# EAGLE design riffle-CTL-0.3-cap (EAGLE 7.3.0)
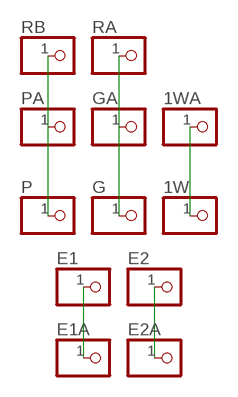
[diagram p0: schematic, sheet 1]

## Parts
1W  PINHD-1X1  [1X01]
1WA  PINHD-1X1  [1X01]
E1  PINHD-1X1  [1X01]
E1A  PINHD-1X1  [1X01]
E2  PINHD-1X1  [1X01]
E2A  PINHD-1X1  [1X01]
G  PINHD-1X1  [1X01]
GA  PINHD-1X1  [1X01]
P  PINHD-1X1  [1X01]
PA  PINHD-1X1  [1X01]
RA  PINHD-1X1  [1X01]
RB  PINHD-1X1  [1X01]

## Nets
N$1: P.1 PA.1 RB.1
N$2: G.1 GA.1 RA.1
N$3: 1W.1 1WA.1
N$4: E1.1 E1A.1
N$5: E2.1 E2A.1

## Library data of the parts
1W 1WA E1 E1A E2 E2A G GA P PA RA RB = pinhead:PINHD-1X1: PIN HEADER

## Net classes
0 default: width 0.203 mm, drill 0.33 mm, clearance 0.203 mm
1 power: width 0.381 mm, clearance 0.254 mm

## Board
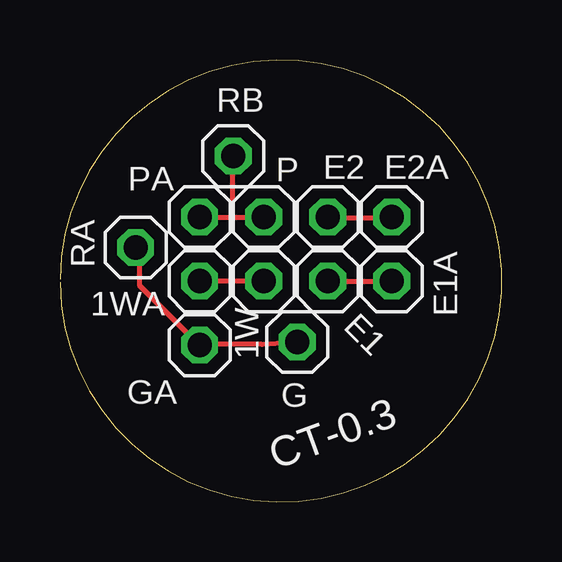
[diagram p1: board, top side]
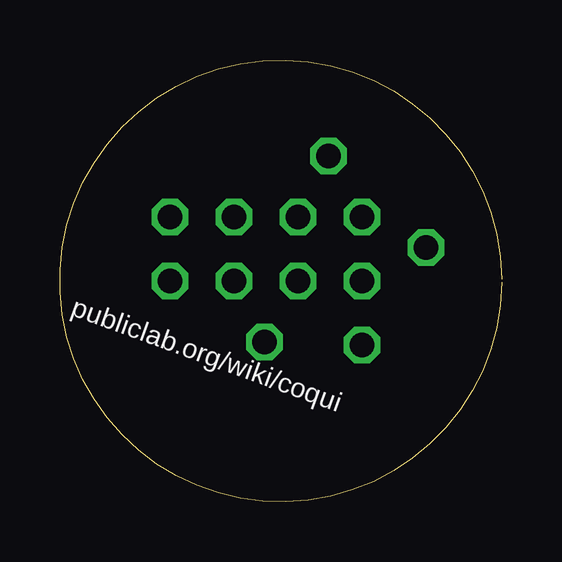
[diagram p2: board, bottom side, seen from below]

Size 18.4 x 18.41 mm. Coordinates in mm from the lower left corner, seen from the top.
Outline: 0,9.14 arc359 0,9.27
Copper layers (1*16): Top 0.0356mm / dielectric 1.5011mm / Bottom 0.0356mm
Design rules "LaenPCBOrder": minimum track width 6mil, minimum drill 13mil, track to track 6mil, track to pad 6mil, pad to pad 6mil, via to via 6mil, smd to smd 6mil, copper to edge 15mil, drill to drill 6mil, minimum pad ring 7mil, minimum via ring 7mil, stop-mask expansion 3mil, vias tented up to drill 0mil, thermal gap 10mil

### Footprints (pad centres in the part's own frame; a part is rotated, then mirrored left to right if it is on the bottom)
1X01 = drill 1.016 octagon: 1 0,0

### Placement (x,y rotation side)
1W  8.49,9.2 0 top
1WA  5.82,9.2 90 top
E1  11.15,9.2 180 top
E1A  13.82,9.2 270 top
E2  11.15,11.87 0 top
E2A  13.82,11.87 0 top
G  9.88,6.66 180 top
GA  5.82,6.54 180 top
P  8.49,11.87 90 top
PA  5.82,11.87 90 top
RA  3.15,10.6 0 top
RB  7.22,14.41 0 top

### Tracks (layer width: path | path; a pad name or v marks a point on that pad's centre or on a via)
N$1
  Top 0.203: 7.19,11.84 8.41,11.84 P.1 | 7.19,11.84 5.97,11.84 PA.1 | 7.19,11.84 7.19,14.28 RB.1
N$2
  Top 0.203: G.1 8.41,6.56 5.97,6.56 GA.1 5.77,6.56 3.33,9 3.33,10.42 RA.1
N$3
  Top 0.203: 1W.1 1WA.1
N$4
  Top 0.203: E1.1 11.26,9.18 13.7,9.18 E1A.1
N$5
  Top 0.203: E2.1 11.26,11.82 13.7,11.82 E2A.1

### Text on the board
tPlace: CT-0.3
bPlace: publiclab.org/wiki/coqui